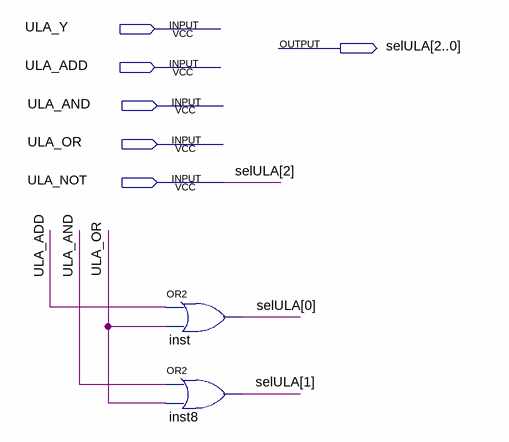
[diagram p0: schematic sheet]
// Quartus schematic ULA_ENCODER.bdf as structural Verilog: 2 symbols, 6 pins
module ULA_ENCODER (
  input  ULA_Y,
  input  ULA_ADD,
  input  ULA_AND,
  input  ULA_OR,
  input  ULA_NOT,
  output [2:0] selULA
);

  or inst (selULA[0], ULA_ADD, ULA_OR);
  or inst8 (selULA[1], ULA_AND, ULA_OR);

  assign selULA[2] = ULA_NOT;
endmodule
